# EAGLE design atmega328_programmer V2 (EAGLE 7.5.0)
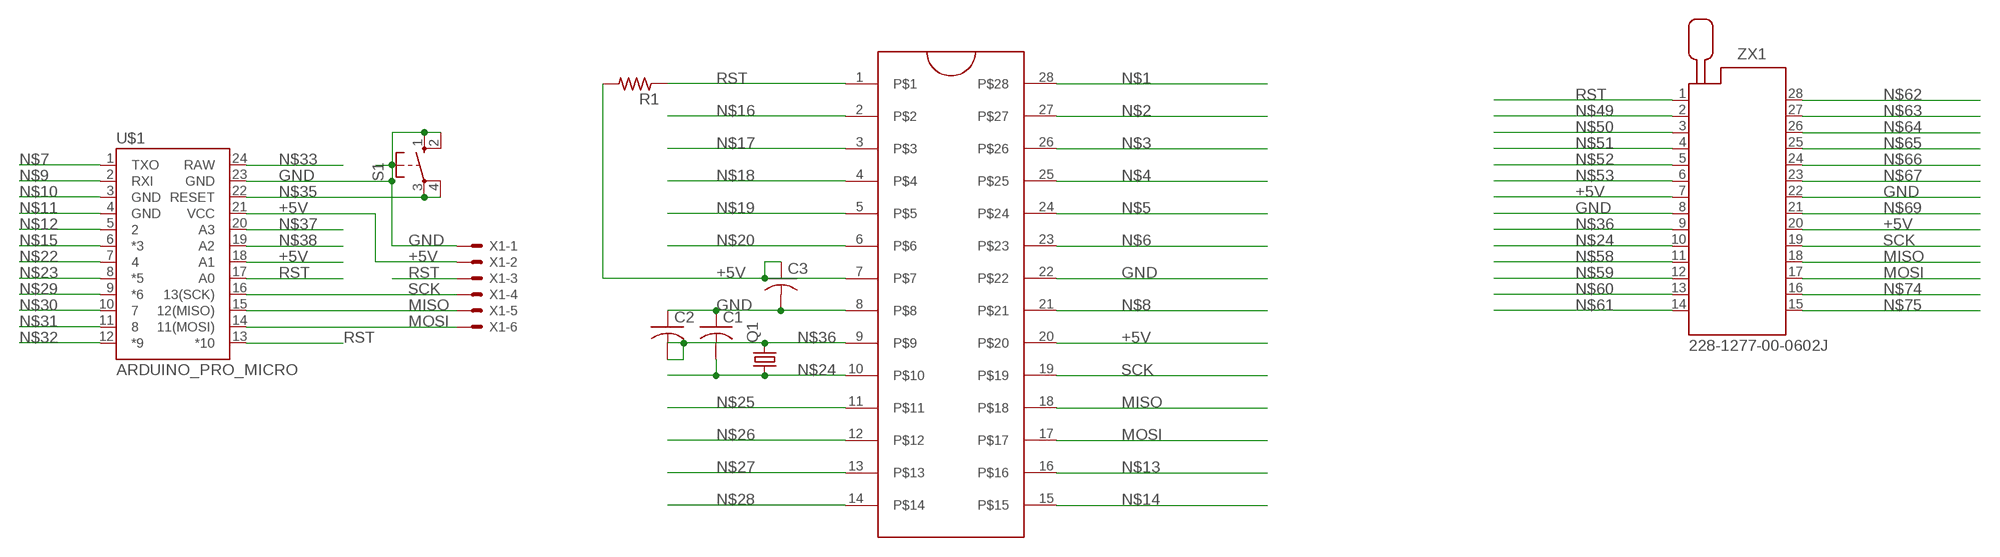
[diagram p0: schematic, sheet 1]

## Parts
C1  C-US025-024X044  [C025-024X044]
C2  C-US025-024X044  [C025-024X044]
C3  C-US025-024X044  [C025-024X044]
Q1  CRYSTALHC49U-V  [HC49U-V]
R1  R-US_0207/10  [0207/10]
S1  10-XX  [B3F-10XX]
U$1  ARDUINO_PRO_MICRO  [ARDUINO_PRO_MICRO]
U$2  ZIFSOCKET-28-3ZIFFSOCKET-28-3  [DIL28-3-ZIF_SOCKET]
X1  22-23-2061  [22-23-2061]
ZX1  228-1277-00-0602J  [228-1277-00-0602J]

## Nets
+5V: C3.1 R1.2 U$1.18(A1) U$1.21(VCC) U$2.7 U$2.20 X1.2 ZX1.7 ZX1.20
GND: C1.1 C2.1 C3.2 S1.1(S) S1.2(S1) U$1.23(GND) U$2.8 U$2.22 X1.1 ZX1.8 ZX1.22
MISO: U$1.15(12(MISO)) U$2.18 X1.5 ZX1.18
MOSI: U$1.14(11(MOSI)) U$2.17 X1.6 ZX1.17
N$1: U$2.28
N$2: U$2.27
N$3: U$2.26
N$4: U$2.25
N$5: U$2.24
N$6: U$2.23
N$7: U$1.1(TXO)
N$8: U$2.21
N$9: U$1.2(RXI)
N$10: U$1.3(GND)
N$11: U$1.4(GND)
N$12: U$1.5
N$13: U$2.16
N$14: U$2.15
N$15: U$1.6(*3)
N$16: U$2.2
N$17: U$2.3
N$18: U$2.4
N$19: U$2.5
N$20: U$2.6
N$22: U$1.7
N$23: U$1.8(*5)
N$24: C1.2 Q1.1 U$2.10 ZX1.10
N$25: U$2.11
N$26: U$2.12
N$27: U$2.13
N$28: U$2.14
N$29: U$1.9(*6)
N$30: U$1.10
N$31: U$1.11
N$32: U$1.12(*9)
N$33: U$1.24(RAW)
N$35: S1.3(P) S1.4(P1) U$1.22(RESET)
N$36: C2.2 Q1.2 U$2.9 ZX1.9
N$37: U$1.20(A3)
N$38: U$1.19(A2)
N$49: ZX1.2
N$50: ZX1.3
N$51: ZX1.4
N$52: ZX1.5
N$53: ZX1.6
N$58: ZX1.11
N$59: ZX1.12
N$60: ZX1.13
N$61: ZX1.14
N$62: ZX1.28
N$63: ZX1.27
N$64: ZX1.26
N$65: ZX1.25
N$66: ZX1.24
N$67: ZX1.23
N$69: ZX1.21
N$74: ZX1.16
N$75: ZX1.15
RST: R1.1 U$1.13(*10) U$1.17(A0) U$2.1 X1.3 ZX1.1
SCK: U$1.16(13(SCK)) U$2.19 X1.4 ZX1.19

## Library data of the parts
C1-C3 = rcl:C-US: CAPACITOR, American symbol
Q1 = crystal:CRYSTAL: CRYSTAL; OC_FARNELL: 1666969; OC_NEWARK: unknown
R1 = rcl:R-US_: RESISTOR, American symbol
S1 = switch-omron:10-XX: OMRON SWITCH; MPN: B3F-1000; OC_FARNELL: 176432; OC_NEWARK: 36M3542
U$1 = SparkFun-Boards:ARDUINO_PRO_MICRO
U$2 = SparkFun-Connectors:ZIFSOCKET-28-3: Lever-action ZIF socket for 28-pin ICs
X1 = con-molex:22-23-2061: .100" (2.54mm) Center Header - 6 Pin; MF: MOLEX; MPN: 22-23-2061; OC_FARNELL: 1462922; OC_NEWARK: 27C1933
ZX1 = con-3m:228-?00-0602J: Zero Insertion Force Socked Source: http://www.3M.com/ehpd; MF: 3M; MPN: 228-1277-00-0602J; OC_FARNELL: 9897356; OC_NEWARK: 85K7825

## Board
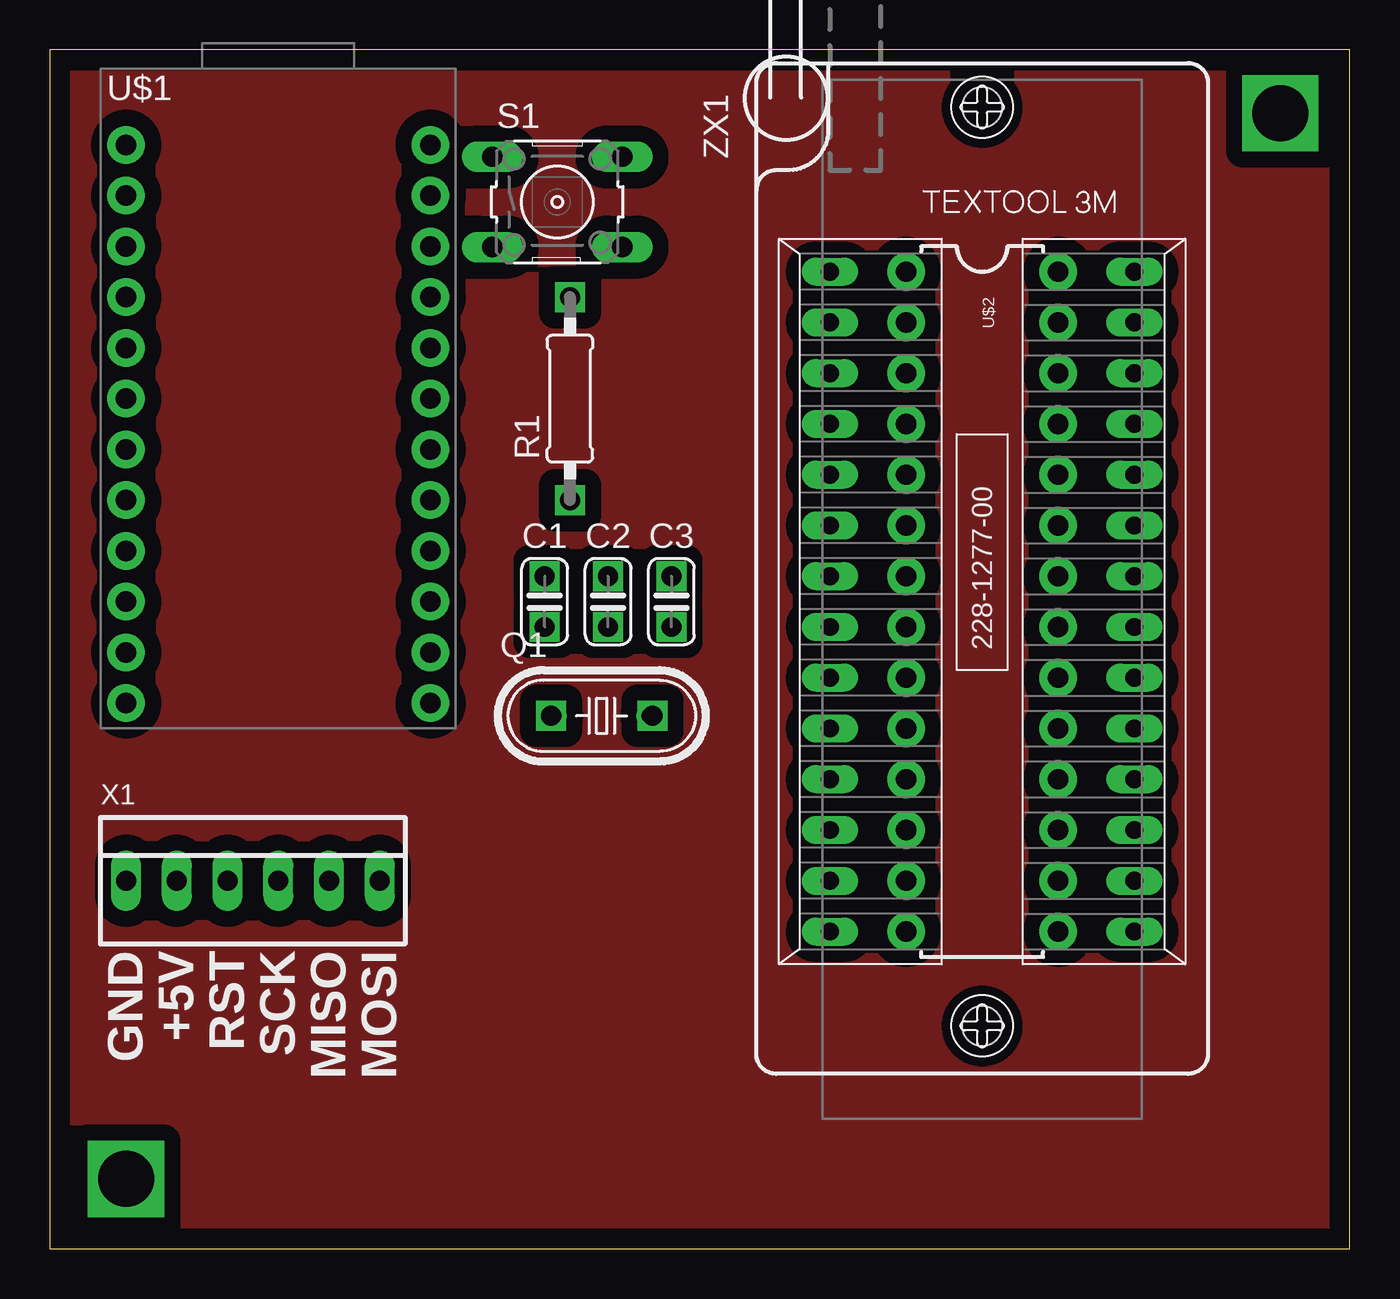
[diagram p1: board, top side]
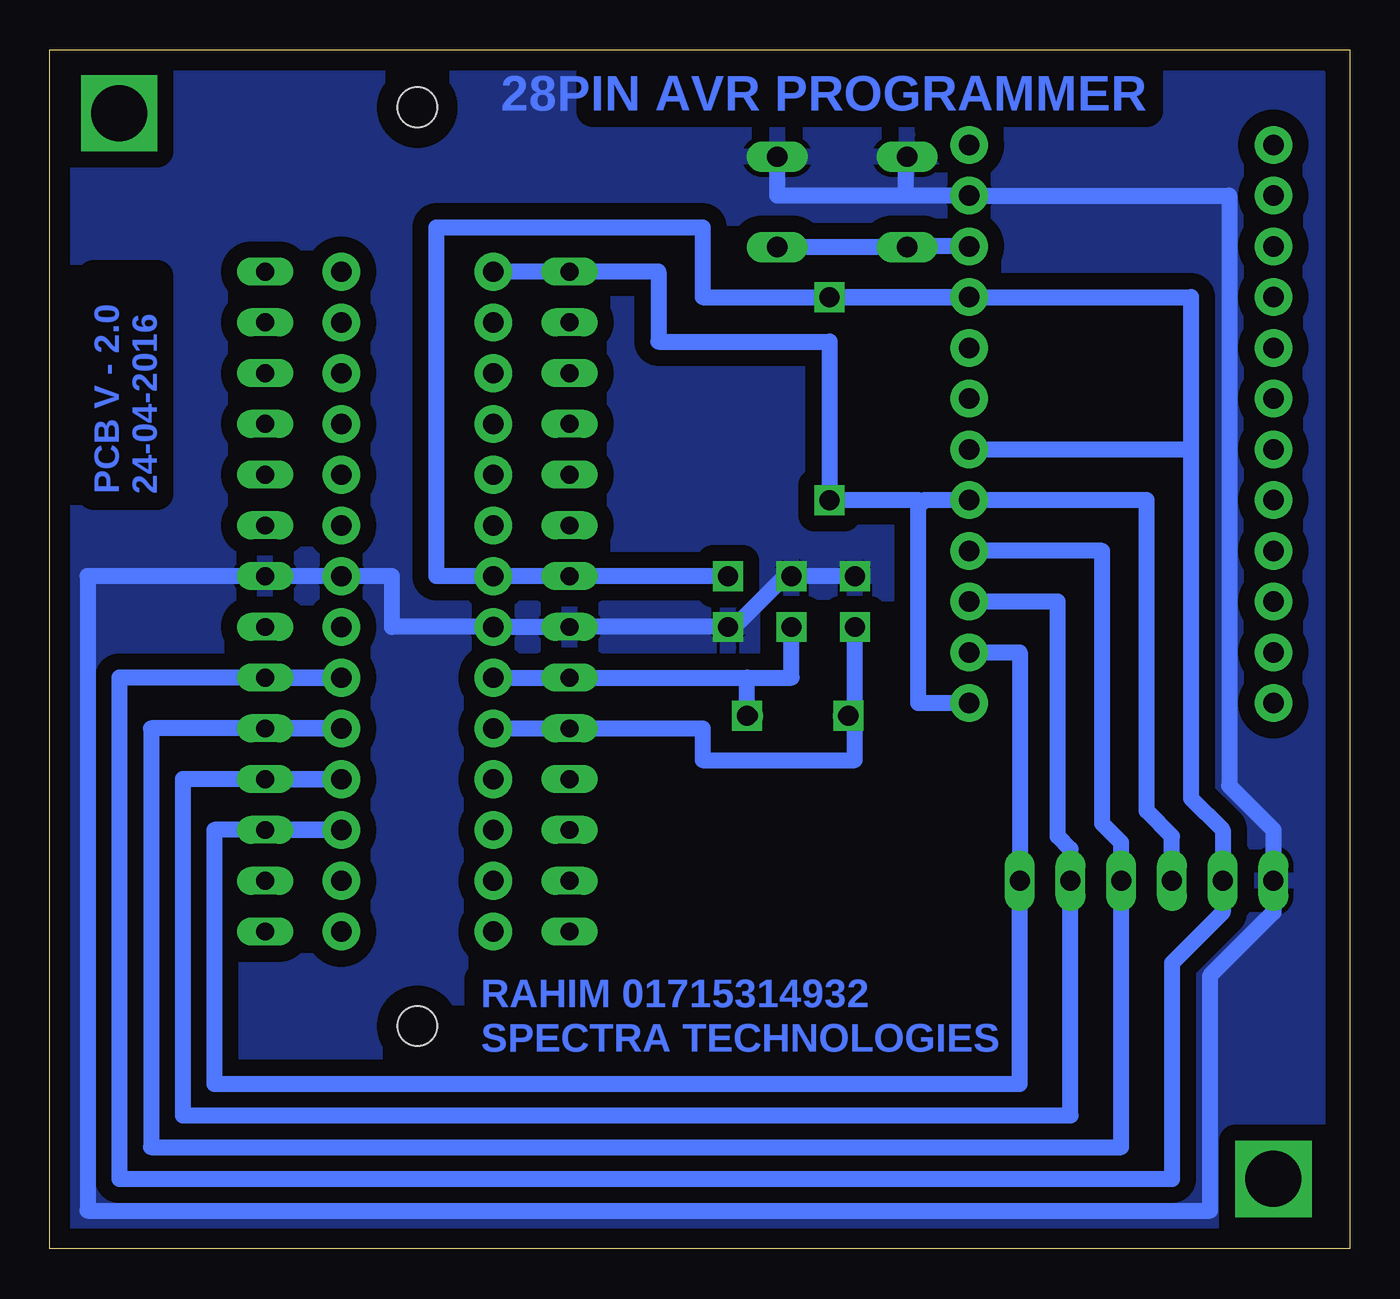
[diagram p2: board, bottom side, seen from below]

Size 65.07 x 59.99 mm. Coordinates in mm from the lower left corner, seen from the top.
Outline: 0,0 65.07,0 65.07,59.99 0,59.99 0,0
Copper layers (1*16): Top 0.035mm / dielectric 1.5mm / Bottom 0.035mm
Design rules "default": minimum track width 10mil, minimum drill 24mil, track to track 8mil, track to pad 8mil, pad to pad 8mil, via to via 8mil, smd to smd 8mil, copper to edge 40mil, drill to drill 8mil, minimum pad ring 10mil, minimum via ring 8mil, stop-mask expansion 4mil, vias tented up to drill 0mil, thermal gap 10mil

### Footprints (pad centres in the part's own frame; a part is rotated, then mirrored left to right if it is on the bottom)
C025-024X044 = drill 0.813 octagon: 1 -1.27,0; 2 1.27,0
HC49U-V = drill 0.813: 1 -2.413,0; 2 2.413,0
0207/10 = drill 0.813 octagon: 1 -5.08,0; 2 5.08,0
B3F-10XX = drill 1.016 long: 1 -3.251,2.261; 2 3.251,2.261; 3 -3.251,-2.261; 4 3.251,-2.261
ARDUINO_PRO_MICRO = drill 1.016 pad 1.88: 1 -7.62,12.7; 2 -7.62,10.16; 3 -7.62,7.62; 4 -7.62,5.08; 5 -7.62,2.54; 6 -7.62,0; 7 -7.62,-2.54; 8 -7.62,-5.08; 9 -7.62,-7.62; 10 -7.62,-10.16; 11 -7.62,-12.7; 12 -7.62,-15.24; 13 7.62,-15.24; 14 7.62,-12.7; 15 7.62,-10.16; 16 7.62,-7.62; 17 7.62,-5.08; 18 7.62,-2.54; 19 7.62,0; 20 7.62,2.54; 21 7.62,5.08; 22 7.62,7.62; 23 7.62,10.16; 24 7.62,12.7
DIL28-3-ZIF_SOCKET = drill 1.016 pad 1.88: 1 -16.51,-3.81; 2 -13.97,-3.81; 3 -11.43,-3.81; 4 -8.89,-3.81; 5 -6.35,-3.81; 6 -3.81,-3.81; 7 -1.27,-3.81; 8 1.27,-3.81; 9 3.81,-3.81; 10 6.35,-3.81; 11 8.89,-3.81; 12 11.43,-3.81; 13 13.97,-3.81; 14 16.51,-3.81; 15 16.51,3.81; 16 13.97,3.81; 17 11.43,3.81; 18 8.89,3.81; 19 6.35,3.81; 20 3.81,3.81; 21 1.27,3.81; 22 -1.27,3.81; 23 -3.81,3.81; 24 -6.35,3.81; 25 -8.89,3.81; 26 -11.43,3.81; 27 -13.97,3.81; 28 -16.51,3.81
22-23-2061 = drill 1 long: 1 -6.35,0; 2 -3.81,0; 3 -1.27,0; 4 1.27,0; 5 3.81,0; 6 6.35,0
228-1277-00-0602J = drill 0.9 long: 1 -16.51,-7.62; 2 -13.97,-7.62; 3 -11.43,-7.62; 4 -8.89,-7.62; 5 -6.35,-7.62; 6 -3.81,-7.62; 7 -1.27,-7.62; 8 1.27,-7.62; 9 3.81,-7.62; 10 6.35,-7.62; 11 8.89,-7.62; 12 11.43,-7.62; 13 13.97,-7.62; 14 16.51,-7.62; 15 16.51,7.62; 16 13.97,7.62; 17 11.43,7.62; 18 8.89,7.62; 19 6.35,7.62; 20 3.81,7.62; 21 1.27,7.62; 22 -1.27,7.62; 23 -3.81,7.62; 24 -6.35,7.62; 25 -8.89,7.62; 26 -11.43,7.62; 27 -13.97,7.62; 28 -16.51,7.62 | hole 2: 21.24,0; -24.74,0

### Placement (x,y rotation side)
C1  24.77,32.38 270 top
C2  27.94,32.38 270 top
C3  31.11,32.38 270 top
Q1  27.62,26.67 0 top
R1  26.04,42.55 90 top
S1  25.4,52.39 0 top
U$1  11.43,42.55 0 top
U$2  46.67,32.38 270 top
X1  10.16,18.41 0 top
ZX1  46.67,32.38 270 top

### Tracks (layer width: path | path; a pad name or v marks a point on that pad's centre or on a via)
+5V  (via drill 1)
  Bottom 0.813: ZX1.20 U$2.20 61.59,28.57 61.59,3.49 8.89,3.49 8.89,14.29 6.35,16.83 X1.2 6.35,20.95 7.94,22.54 7.94,40.01 | C3.1 ZX1.7 U$2.7 45.72,33.66 45.72,51.12 32.38,51.12 32.38,47.62 R1.2 | U$1.21 R1.2 | R1.2 7.94,47.62 7.94,40.01 | U$1.18 7.94,40.01
  other vias: 31.11,33.66 26.04,47.62
GND  (via drill 1)
  Bottom 0.813: C1.1 C2.1 28.26,33.66 30.8,31.11 C3.2 ZX1.8 U$2.8 47.94,31.11 47.94,33.66 U$2.22 | U$2.22 ZX1.22 | 22.23,52.7 U$1.23 6.03,52.7 6.03,23.18 3.81,20.95 X1.1 3.81,16.83 6.99,13.65 6.99,1.91 63.18,1.91 63.18,33.66 U$2.22 | 22.23,52.7 28.65,52.7 S1.2 | S1.1 22.23,54.65 22.23,52.7
  other vias: 24.77,33.66 27.94,33.66 31.11,31.11
  pour Bottom (isolate 0.813): 1.59,58.74 64.14,58.74 64.14,1.27 1.59,1.27
GND1
  pour Top (isolate 0.813): 0.95,58.74 64.45,58.74 64.45,0.64 0.95,0.64
MISO
  Bottom 0.813: ZX1.18 U$2.18 58.42,23.5 58.42,6.67 13.97,6.67 X1.5 13.97,20 14.61,20.64 14.61,32.38 U$1.15
MOSI
  Bottom 0.813: ZX1.17 U$2.17 56.83,20.95 56.83,8.26 16.51,8.26 X1.6 16.51,29.84 U$1.14
N$24
  Bottom 0.813: U$2.10 ZX1.10 32.38,26.04 32.38,24.45 24.77,24.45 24.77,26.67 | 24.77,26.67 C1.2 | Q1.1 24.77,26.67
N$34  (via drill 2.8)
  other vias: 3.81,3.49
N$35
  Bottom 0.813: U$1.22 22.15,50.16 S1.3 S1.4
N$36
  Bottom 0.813: U$2.9 ZX1.9 30.16,28.57 | 30.16,28.57 27.94,28.57 C2.2 | Q1.2 30.16,26.67 30.16,28.57
N$40  (via drill 2.8)
  other vias: 61.59,56.83
N$41  (via drill 1)
  other vias: 24.77,31.11
N$42  (via drill 1)
  other vias: 27.94,31.11
N$47  (via drill 1)
  other vias: 30.16,26.67
N$48  (via drill 1)
  other vias: 25.08,26.67
RST  (via drill 1)
  Bottom 0.813: U$1.13 21.59,27.3 21.59,37.15 | 21.59,37.15 21.59,37.47 R1.1 26.04,45.4 34.61,45.4 34.61,48.9 ZX1.1 U$2.1 | 21.59,37.15 21.27,37.47 U$1.17 10.16,37.47 10.16,21.91 8.89,20.64 X1.3
  other vias: 26.04,37.47
SCK
  Bottom 0.813: ZX1.19 U$2.19 60.01,26.04 60.01,5.08 11.43,5.08 X1.4 11.43,20.32 12.38,21.27 12.38,34.92 U$1.16

### Text on the board
Bottom: 28PIN AVR PROGRAMMER | PCB V - 2.0 / 24-04-2016 | RAHIM 01715314932 | SPECTRA TECHNOLOGIES
tPlace: GND | +5V | RST | SCK | MISO | MOSI